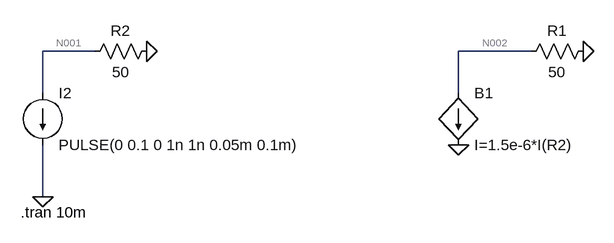
[diagram p0: schematic photodiodeMaybe.asc]
photodiodeMaybe.asc, the LTspice schematic file:
Version 4
SHEET 1 880 680
WIRE -192 96 -272 96
WIRE 480 96 368 96
WIRE -272 160 -272 96
WIRE 368 160 368 96
WIRE -272 320 -272 240
FLAG -272 320 0
FLAG -112 96 0
FLAG 560 96 0
FLAG 368 240 0
SYMBOL current -272 160 R0
WINDOW 123 0 0 Left 0
WINDOW 39 0 0 Left 0
SYMATTR InstName I2
SYMATTR Value PULSE(0 0.1 0 1n 1n 0.05m 0.1m)
SYMBOL res -96 80 R90
WINDOW 0 0 56 VBottom 2
WINDOW 3 32 56 VTop 2
SYMATTR InstName R2
SYMATTR Value 50
SYMBOL res 576 80 R90
WINDOW 0 0 56 VBottom 2
WINDOW 3 32 56 VTop 2
SYMATTR InstName R1
SYMATTR Value 50
SYMBOL bi 368 160 R0
SYMATTR InstName B1
SYMATTR Value I=1.5e-6*I(R2)
TEXT -306 344 Left 2 !.tran 10m

The netlist it stands for:
* photodiodeMaybe.asc
I2 N001 0 PULSE(0 0.1 0 1n 1n 0.05m 0.1m)
R2 0 N001 50
R1 0 N002 50
B1 N002 0 I=1.5e-6*I(R2)
.tran 10m
.backanno
.end

* Results of the author's LTspice run, read from the files saved beside the schematic
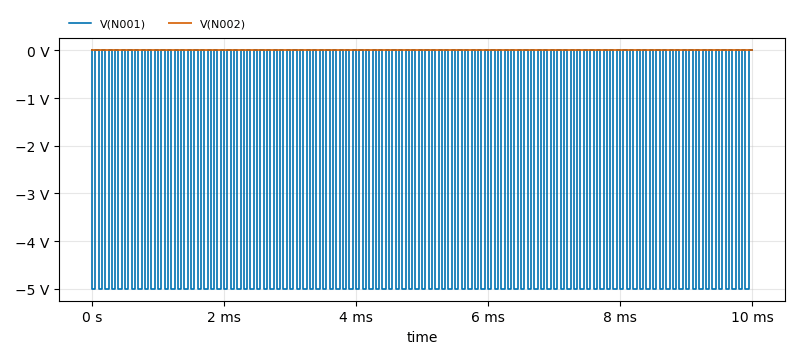
[diagram p1: Transient Analysis of photodiodeMaybe.asc, plotted from the saved traces]
* Transient Analysis, 1 run:
*   V(N001): min -5 V, max 0 V, average -2.5 V, rms 3.536 V, last 0 V
*   V(N002): min -7.5 µV, max 0 V, average -3.75 µV, rms 5.303 µV, last 0 V